# EAGLE design Trefferzonenmodul (EAGLE 7.2.0)
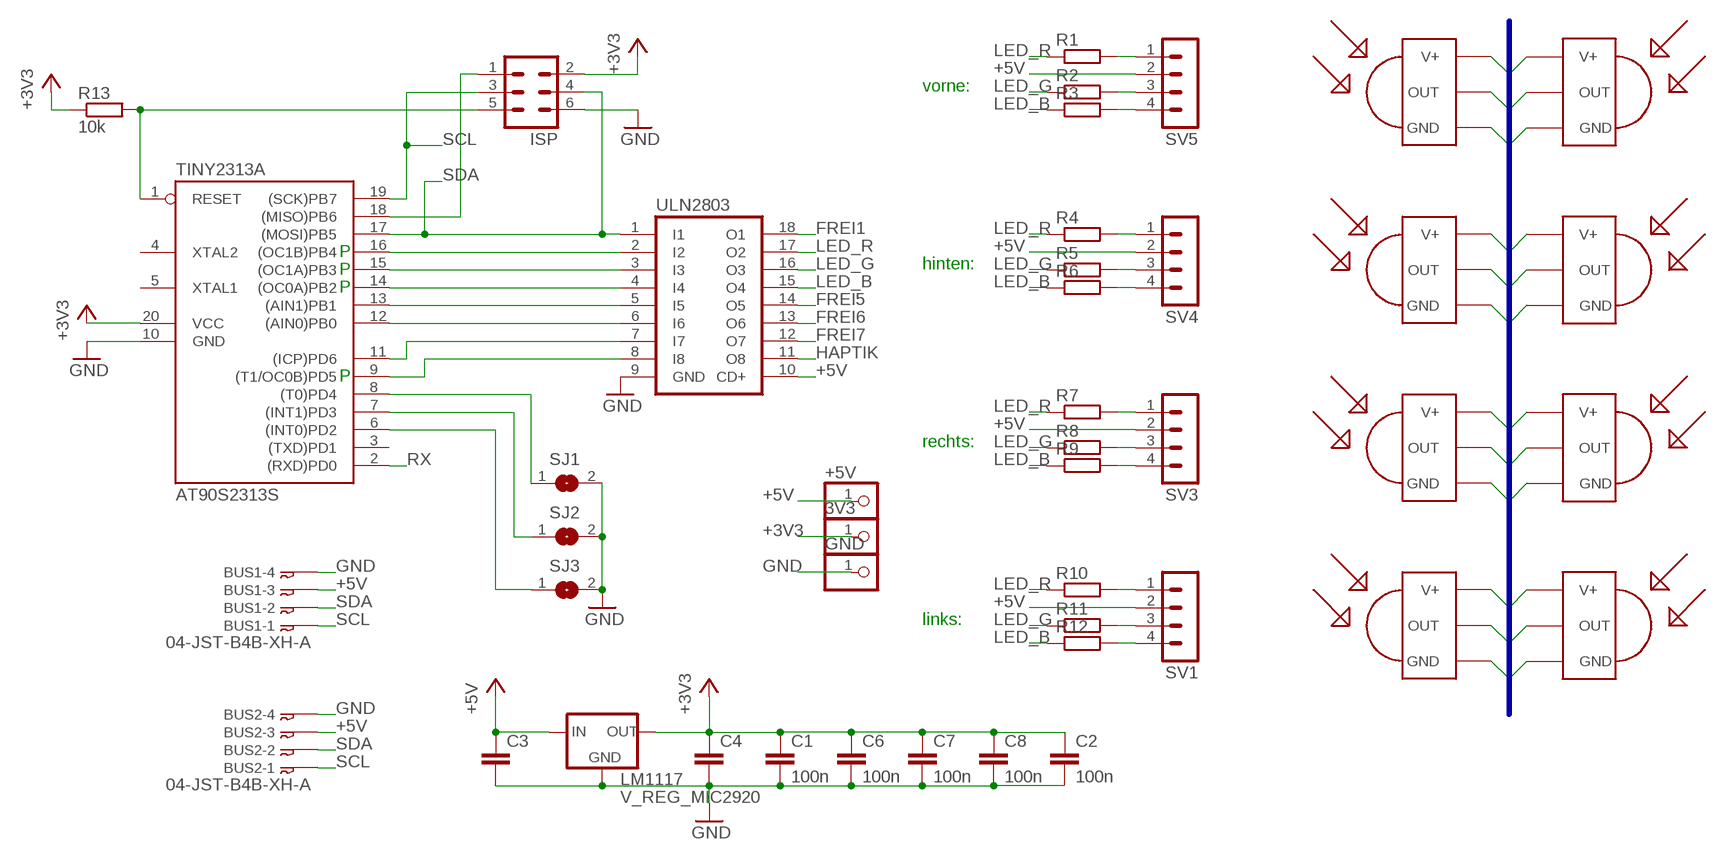
[diagram p0: schematic, sheet 1]

## Parts
3V3  PINHD-1X1  [1X01]
+5V  PINHD-1X1  [1X01]
BUS1  04-JST-B4B-XH-A  [B4B-XH]
BUS2  04-JST-B4B-XH-A  [B4B-XH]
C1  100n  C-EUC0805  [C0805]
C2  100n  C-EUC0805  [C0805]
C3  C-EUC1210  [C1210]
C4  C-EUC1210  [C1210]
C6  100n  C-EUC0805  [C0805]
C7  100n  C-EUC0805  [C0805]
C8  100n  C-EUC0805  [C0805]
GND  PINHD-1X1  [1X01]
ISP  MA03-2  [MA03-2]
LM1117  V_REG_MIC2920  [SOT223]
R1  R-EU_R0805  [R0805]
R2  R-EU_R0805  [R0805]
R3  R-EU_R0805  [R0805]
R4  R-EU_R0805  [R0805]
R5  R-EU_R0805  [R0805]
R6  R-EU_R0805  [R0805]
R7  R-EU_R0805  [R0805]
R8  R-EU_R0805  [R0805]
R9  R-EU_R0805  [R0805]
R10  R-EU_R0805  [R0805]
R11  R-EU_R0805  [R0805]
R12  R-EU_R0805  [R0805]
R13  10k  R-EU_R0805  [R0805]
SJ1  SJ  [SJ]
SJ2  SJ  [SJ]
SJ3  SJ  [SJ]
SV1  MA04-1  [MA04-1]
SV3  MA04-1  [MA04-1]
SV4  MA04-1  [MA04-1]
SV5  MA04-1  [MA04-1]
TINY2313A  AT90S2313S  [SO20L]
U$1  TSOP1838  [TSOP18XX]
U$2  TSOP1838  [TSOP18XX]
U$3  TSOP1838  [TSOP18XX]
U$4  TSOP1838  [TSOP18XX]
U$5  TSOP1838  [TSOP18XX]
U$6  TSOP1838  [TSOP18XX]
U$7  TSOP1838  [TSOP18XX]
U$8  TSOP1838  [TSOP18XX]
ULN2803  ULN2803ASO18  [SO18W]

## Nets
+3V3: 3V3.1 C1.1 C2.1 C4.1 C6.1 C7.1 C8.1 ISP.2 LM1117.2(OUT) LM1117.4(OUT) R13.1 TINY2313A.20(VCC) U$1.VCC(V+) U$2.VCC(V+) U$3.VCC(V+) U$4.VCC(V+) U$5.VCC(V+) U$6.VCC(V+) U$7.VCC(V+) U$8.VCC(V+)
+5V: +5V.1 BUS1.P$3 BUS2.P$3 C3.1 LM1117.3(IN) SV1.2 SV3.2 SV4.2 SV5.2 ULN2803.10(CD+)
FREI1: ULN2803.18(O1)
FREI5: ULN2803.14(O5)
FREI6: ULN2803.13(O6)
FREI7: ULN2803.12(O7)
GND: BUS1.P$4 BUS2.P$4 C1.2 C2.2 C3.2 C4.2 C6.2 C7.2 C8.2 GND.1 ISP.6 LM1117.1(GND) SJ1.2 SJ2.2 SJ3.2 TINY2313A.10(GND) U$1.GND U$2.GND U$3.GND U$4.GND U$5.GND U$6.GND U$7.GND U$8.GND ULN2803.9(GND)
HAPTIK: ULN2803.11(O8)
LED_B: R3.1 R6.1 R9.1 R12.1 ULN2803.15(O4)
LED_G: R2.1 R5.1 R8.1 R11.1 ULN2803.16(O3)
LED_R: R1.1 R4.1 R7.1 R10.1 ULN2803.17(O2)
N$1: ISP.1 TINY2313A.18((MISO)PB6)
N$2: SJ1.1 TINY2313A.8((T0)PD4)
N$3: TINY2313A.16((OC1B)PB4) ULN2803.2(I2)
N$4: TINY2313A.15((OC1A)PB3) ULN2803.3(I3)
N$5: R10.2 SV1.1
N$6: R11.2 SV1.3
N$7: TINY2313A.14((OC0A)PB2) ULN2803.4(I4)
N$8: TINY2313A.13((AIN1)PB1) ULN2803.5(I5)
N$9: TINY2313A.12((AIN0)PB0) ULN2803.6(I6)
N$10: TINY2313A.11((ICP)PD6) ULN2803.7(I7)
N$11: TINY2313A.9((T1/OC0B)PD5) ULN2803.8(I8)
N$12: R12.2 SV1.4
N$13: R7.2 SV3.1
N$14: R8.2 SV3.3
N$15: R9.2 SV3.4
N$16: R4.2 SV4.1
N$17: R5.2 SV4.3
N$18: SJ2.1 TINY2313A.7((INT1)PD3)
N$19: SJ3.1 TINY2313A.6((INT0)PD2)
N$22: R6.2 SV4.4
N$23: ISP.5 R13.2 TINY2313A.1(RESET)
N$24: R1.2 SV5.1
N$25: R2.2 SV5.3
N$26: R3.2 SV5.4
RX: TINY2313A.2((RXD)PD0) U$1.OUT U$2.OUT U$3.OUT U$4.OUT U$5.OUT U$6.OUT U$7.OUT U$8.OUT
SCL: BUS1.P$1 BUS2.P$1 ISP.3 TINY2313A.19((SCK)PB7)
SDA: BUS1.P$2 BUS2.P$2 ISP.4 TINY2313A.17((MOSI)PB5) ULN2803.1(I1)
Unconnected: TINY2313A.3((TXD)PD1) TINY2313A.4(XTAL2) TINY2313A.5(XTAL1)

## Buses
+3V3,GND,RX

## Notes on the sheet
- vorne:
- P
- hinten:
- P
- P
- P
- rechts:
- links:

## Library data of the parts
3V3 +5V GND = wz:PINHD-1X1: PIN HEADER
BUS1 BUS2 = wz:04-JST: JST CONNECTOR
C1-C4 C6-C8 = rcl:C-EU: CAPACITOR, European symbol
ISP = con-lstb:MA03-2: PIN HEADER; OC_FARNELL: unknown; OC_NEWARK: unknown
LM1117 = wz:V_REG_MIC2920: MIC2920A (http://www.micrel.com/_PDF/mic2920.pdf) - 400mA output LDO Regulator
R1-R13 = rcl:R-EU_: RESISTOR, European symbol
SJ1-SJ3 = jumper:SJ: SMD solder JUMPER
SV1 SV3-SV5 = con-lstb:MA04-1: PIN HEADER; OC_FARNELL: unknown; OC_NEWARK: unknown
TINY2313A = wz:AT90S2313: MICROCONTROLLER 2 Kbytes FLASH 128 bytes SRAM 128 bytes EEPROM UART; OC_FARNELL: unknown; OC_NEWARK: unknown
U$1-U$8 = tsop:TSOP1838: IR Receiver and Demodulator
ULN2803 = wz:ULN2803A: DRIVER ARRAY

## Net classes
0 default: width 0.016 mm

## Board
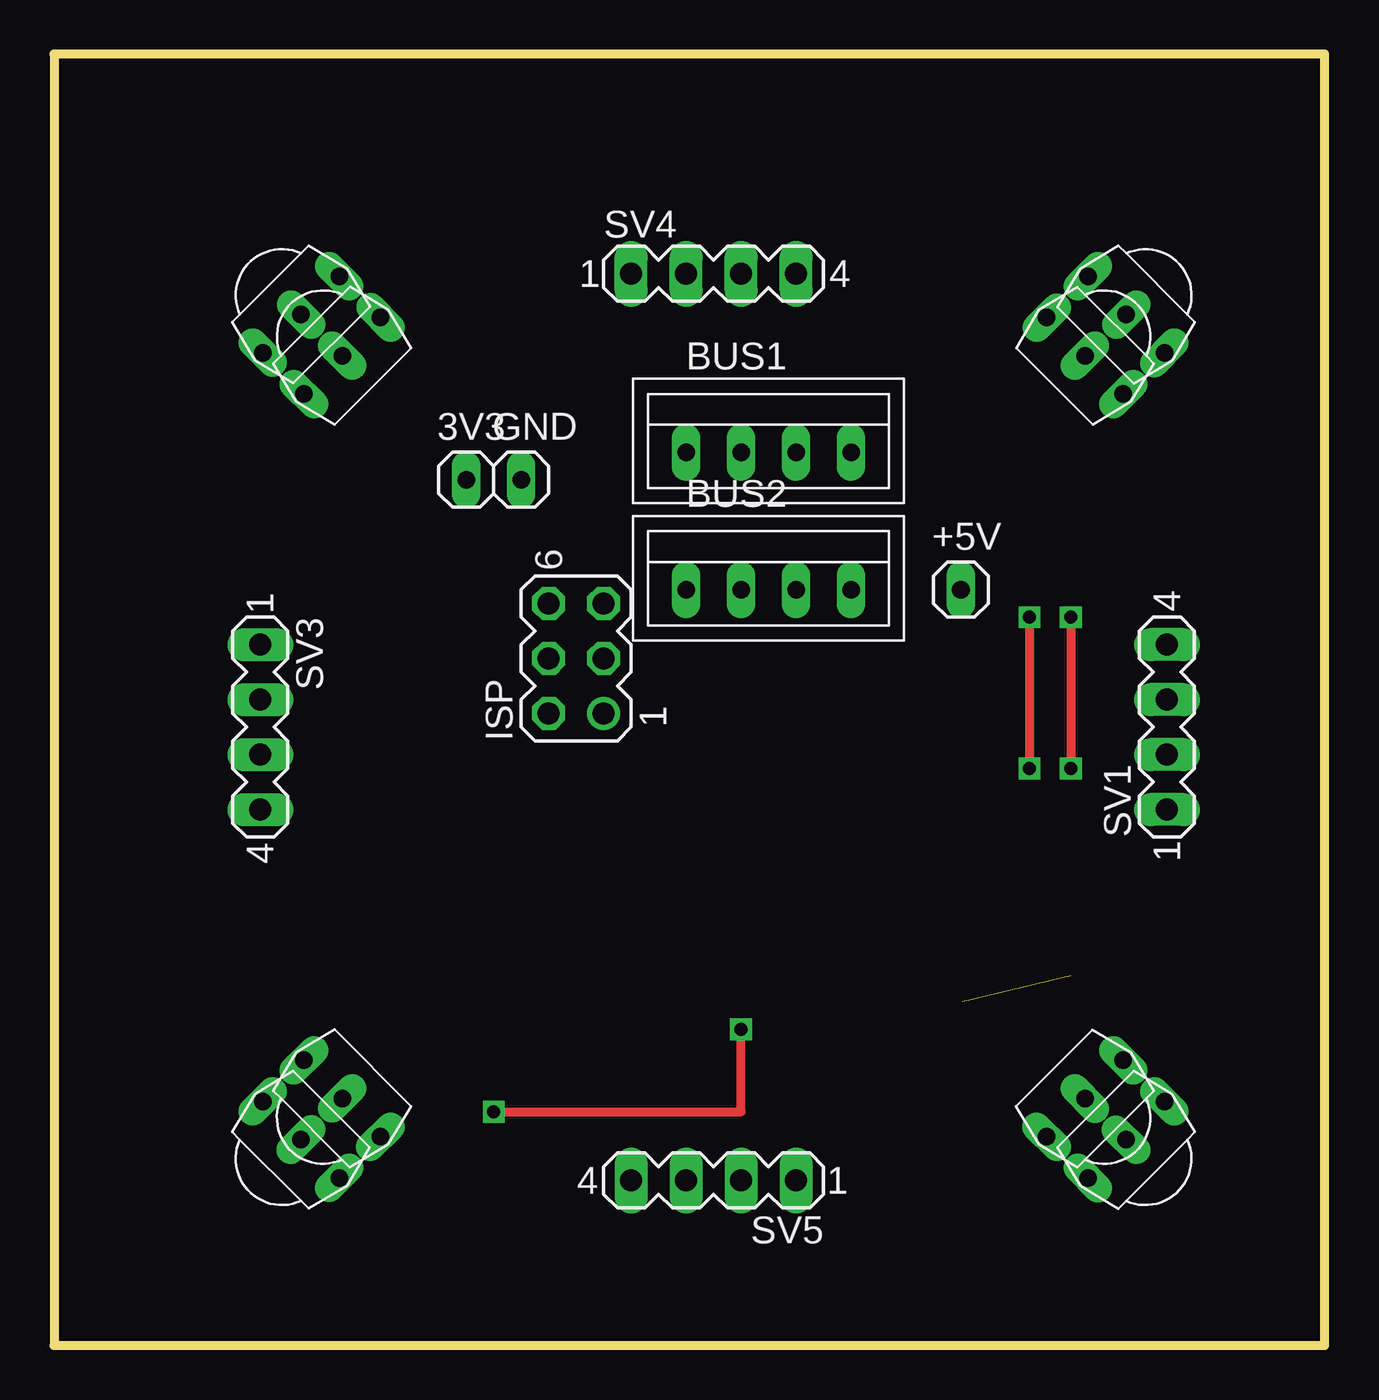
[diagram p1: board, top side]
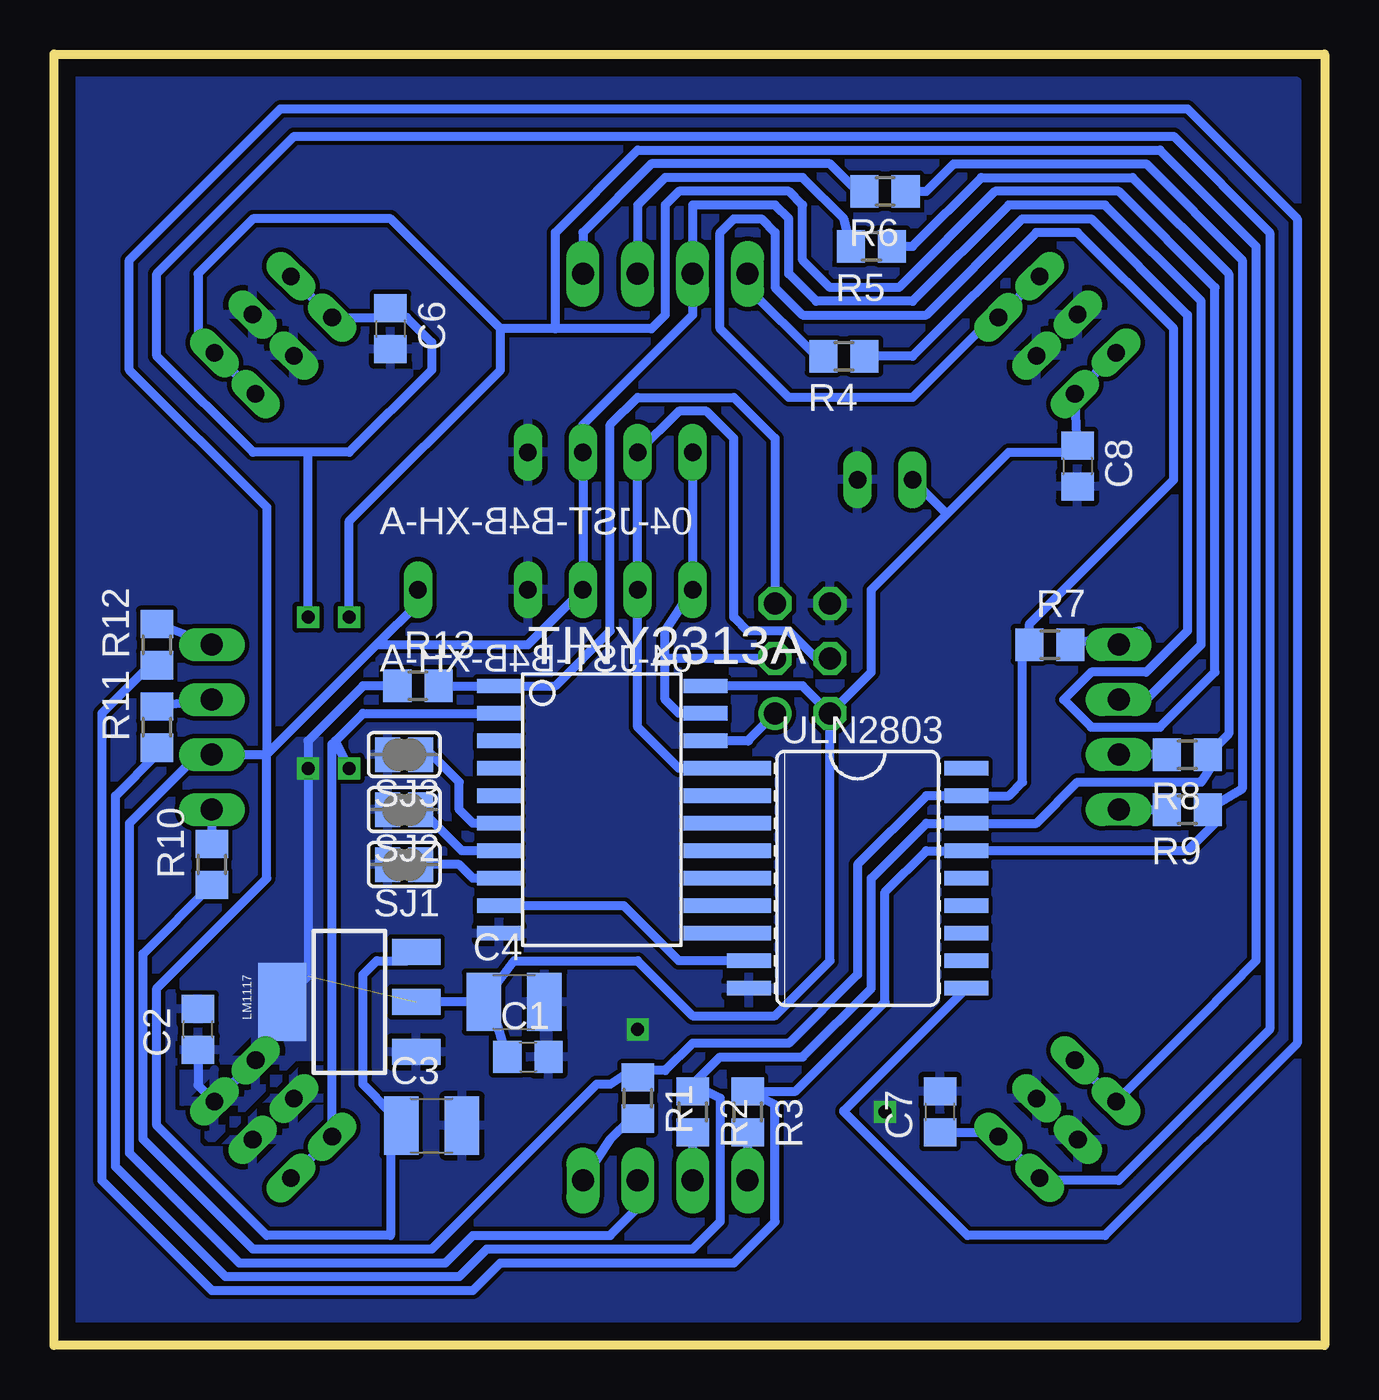
[diagram p2: board, bottom side, seen from below]

Size 58.73 x 59.68 mm. Coordinates in mm from the lower left corner, seen from the top.
Outline: 0,0 58.73,0 58.73,59.68 0,59.68 0,0
Copper layers (1*16): Top 0.035mm / dielectric 1.5mm / Bottom 0.035mm
Design rules "cnc": minimum track width 10mil, minimum drill 0.1mm, track to track 8mil, track to pad 8mil, pad to pad 8mil, via to via 8mil, smd to smd 8mil, copper to edge 30mil, drill to drill 8mil, minimum pad ring 10mil, minimum via ring 8mil, stop-mask expansion 4mil, vias tented up to drill 0mil, thermal gap 10mil

### Footprints (pad centres in the part's own frame; a part is rotated, then mirrored left to right if it is on the bottom)
1X01 = drill 0.813 long: 1 0,0
B4B-XH = drill 0.813 long: P$1 -3.81,0; P$2 -1.27,0; P$3 1.27,0; P$4 3.81,0
C0805 = smd 1.3 x 1.5: 1 -0.95,0; 2 0.95,0
C1210 = smd 1.6 x 2.7: 1 -1.4,0; 2 1.4,0
MA03-2 = drill 1.016: 1 -2.54,-1.27 | drill 1.016 octagon: 2 -2.54,1.27; 3 0,-1.27; 4 0,1.27; 5 2.54,-1.27; 6 2.54,1.27
SOT223 = smd 1.219 x 2.235: 1 -2.311,-3.099; 2 0,-3.099; 3 2.311,-3.099 | smd 3.6 x 2.2: 4 0,3.099
R0805 = smd 1.3 x 1.5: 1 -0.95,0; 2 0.95,0
SJ = smd 1.168 x 1.6: 1 -0.762,0; 2 0.762,0
MA04-1 = drill 1.016 long: 1 -3.81,0; 2 -1.27,0; 3 1.27,0; 4 3.81,0
SO20L = smd 0.66 x 2.032: 1 -5.08,-5.131; 2 -3.81,-5.131; 3 -2.54,-5.131; 4 -1.27,-5.131; 5 0,-5.131; 6 1.27,-5.131; 7 2.54,-5.131; 8 3.81,-5.131; 9 5.08,-5.131; 10 6.35,-5.131; 11 6.35,4.394; 12 5.08,4.394; 13 3.81,4.394; 14 2.54,4.394; 15 1.27,4.394; 16 0,4.394; 17 -1.27,4.394; 18 -2.54,4.394; 19 -3.81,4.394; 20 -5.08,4.394
TSOP18XX = drill 0.813 long: GND -0.001,-0.027; OUT -2.501,-0.027; VCC 2.499,-0.027
SO18W = smd 0.66 x 2.032: 1 -5.08,-5.029; 2 -3.81,-5.029; 3 -2.54,-5.029; 4 -1.27,-5.029; 5 0,-5.029; 6 1.27,-5.029; 7 2.54,-5.029; 8 3.81,-5.029; 9 5.08,-5.029; 10 5.08,5.029; 11 3.81,5.029; 12 2.54,5.029; 13 1.27,5.029; 14 0,5.029; 15 -1.27,5.029; 16 -2.54,5.029; 17 -3.81,5.029; 18 -5.08,5.029

### Placement (x,y rotation side)
3V3  19.05,40.01 0 top
+5V  41.91,34.92 0 top
BUS1  33.02,41.27 0 top
BUS2  33.02,34.92 0 top
C1  36.83,13.34 0 bottom
C2  52.07,14.61 90 bottom
C3  41.27,10.16 0 bottom
C4  37.47,15.88 0 bottom
C6  43.18,46.99 270 bottom
C7  17.78,10.79 90 bottom
C8  11.43,40.64 270 bottom
GND  21.59,40.01 0 top
ISP  24.13,31.75 90 top
LM1117  45.09,15.88 90 bottom
R1  31.75,11.43 270 bottom
R2  29.21,10.79 270 bottom
R3  26.67,10.79 270 bottom
R4  22.23,45.72 180 bottom
R5  20.95,50.8 180 bottom
R6  20.32,53.34 180 bottom
R7  12.7,32.38 0 bottom
R8  6.35,27.3 180 bottom
R9  6.35,24.77 180 bottom
R10  51.44,22.23 90 bottom
R11  53.98,28.57 90 bottom
R12  53.98,32.38 90 bottom
R13  41.91,30.48 0 bottom
SJ1  42.55,22.23 180 bottom
SJ2  42.55,24.77 180 bottom
SJ3  42.55,27.3 180 bottom
SV1  51.44,28.57 90 top
SV3  9.53,28.57 270 top
SV4  30.48,49.53 0 top
SV5  30.48,7.62 180 top
TINY2313A  33.02,25.4 270 bottom
U$1  49.53,47.62 135 top
U$2  11.43,47.62 225 top
U$3  11.43,9.53 315 top
U$4  49.53,9.53 45 top
U$5  13.34,11.43 315 top
U$6  47.62,11.43 45 top
U$7  47.62,45.72 135 top
U$8  13.34,45.72 225 top
ULN2803  21.59,21.59 270 bottom

### Tracks (layer width: path | path; a pad name or v marks a point on that pad's centre or on a via)
+3V3  (via drill 0.6)  (1 unrouted)
  Top 0.406: v46.99,33.66 v46.99,26.67
  Bottom 0.406: C1.1 38.41,15.43 C4.1 | C4.1 LM1117.2 | C4.1 37.47,17.78 31.75,17.78 29.21,15.24 25.4,15.24 22.86,17.78 ISP.2 | ISP.2 24.13,30.48 TINY2313A.20 | ISP.2 20.95,31.11 20.95,34.92 17.46,38.42 | U$2.VCC U$8.VCC C8.1 11.74,41.27 14.61,41.27 17.46,38.42 | U$1.VCC U$7.VCC 43.61,47.51 | 43.61,47.51 C6.1 | C7.1 15.28,9.85 U$5.VCC U$3.VCC 13.06,7.62 9.53,7.62 2.54,14.61 2.54,51.44 6.99,55.88 47.62,55.88 53.98,49.53 53.98,45.72 49.53,41.27 46.99,41.27 | 43.61,47.51 42.43,47.51 41.27,46.35 41.27,45.09 45.09,41.27 46.99,41.27 | R13.1 44.45,30.48 46.99,27.94 v46.99,26.67 46.99,17.07 LM1117.4 U$6.VCC U$4.VCC 52.07,12.03 C2.1 | v46.99,33.66 46.99,41.27 | 3V3.1 17.46,38.42
  pour Bottom: 46.35,13.34 47.62,13.34 51.44,9.53 52.7,10.79 52.7,14.61 51.44,14.61 51.44,16.51 52.7,16.51 52.7,17.14 48.26,21.59 48.26,27.3 47.62,27.94 46.35,27.94
+5V
  Bottom 0.406: SV5.2 31.75,6.35 33.02,5.08 39.37,5.08 40.64,3.81 50.16,3.81 55.24,8.89 55.24,24.13 52.07,27.3 SV1.2 48.9,27.3 | SV3.2 8.26,29.84 5.71,32.38 5.71,48.26 10.16,52.7 14.61,52.7 19.05,48.26 23.5,48.26 24.77,49.53 24.77,52.07 25.4,52.7 29.21,52.7 SV4.2 29.21,47.62 34.29,42.55 BUS1.P$3 BUS2.P$3 36.83,32.38 43.81,32.38 | 48.9,27.3 43.81,32.38 | 48.9,27.3 48.9,21.59 53.98,16.51 53.98,10.16 48.9,5.08 43.18,5.08 43.18,10.16 C3.1 43.95,11.56 44.45,12.06 44.45,17.14 43.81,17.78 42.39,17.78 LM1117.3 | 48.9,27.3 48.9,38.73 55.24,45.09 55.24,50.16 48.26,57.15 6.35,57.15 1.27,52.07 1.27,13.97 10.16,5.08 16.51,5.08 22.23,10.79 22.23,10.85 ULN2803.10 | 43.81,32.38 41.91,34.29 +5V.1
GND  (via drill 0.6)
  Top 0.406: v20.32,10.79 31.75,10.79 v31.75,14.61
  pour Bottom (rank 2): 1.27,58.42 57.78,58.42 57.78,1.27 1.27,1.27
LED_B
  Bottom 0.406: R6.1 18.41,53.34 17.14,54.61 8.26,54.61 3.81,50.16 3.81,25.72 R9.1 5.08,24.77 5.08,24.13 6.35,22.86 ULN2803.15 18.41,22.86 20.32,20.95 20.32,15.88 24.45,11.74 R3.1 25.4,11.11 25.4,5.71 27.3,3.81 38.1,3.81 39.37,2.54 51.44,2.54 56.52,7.62 56.52,29.21 54.29,31.43 R12.1
LED_G
  Bottom 0.406: R2.1 29.21,12.06 | 29.21,12.06 27.94,13.34 24.13,13.34 20.95,16.51 20.95,21.59 18.41,24.13 ULN2803.16 13.34,24.13 11.43,26.04 5.71,26.04 5.08,26.99 R8.1 4.45,28.26 4.45,49.53 8.89,53.98 15.88,53.98 19.05,50.8 R5.1 | 29.21,12.06 27.94,11.43 27.94,5.71 29.21,4.45 38.73,4.45 40.01,3.17 50.8,3.17 55.88,8.26 55.88,25.4 53.98,27.3 R11.1
LED_R
  Bottom 0.406: 32.06,12.7 30.48,12.7 29.21,13.97 24.77,13.97 21.59,17.14 21.59,22.23 18.41,25.4 ULN2803.17 14.61,25.4 13.97,26.04 13.97,32.06 R7.1 13.65,33.34 6.99,40.01 6.99,46.99 11.43,51.44 13.34,51.44 19.05,45.72 R4.1 | 32.06,12.7 R1.1 | 32.06,12.7 33.02,12.06 33.66,12.06 41.27,4.45 49.53,4.45 54.61,9.53 54.61,18.1 R10.1
N$1
  Bottom 0.406: 26.67,27.94 TINY2313A.18 | 26.67,27.94 ISP.1 | 26.67,27.94 26.62,27.94
N$2
  Bottom 0.406: TINY2313A.8 39.37,21.59 40.01,22.23 SJ1.1
N$3
  Bottom 0.406: ULN2803.2 TINY2313A.16
N$4
  Bottom 0.406: TINY2313A.15 ULN2803.3
N$5
  Bottom 0.406: SV1.1 R10.2
N$6
  Bottom 0.406: SV1.3 R11.2
N$7
  Bottom 0.406: TINY2313A.14 ULN2803.4
N$8
  Bottom 0.406: ULN2803.5 TINY2313A.13
N$9
  Bottom 0.406: TINY2313A.12 ULN2803.6
N$10
  Bottom 0.406: ULN2803.7 TINY2313A.11
N$11
  Bottom 0.406: ULN2803.8 29.84,17.78 32.38,20.32 TINY2313A.9
N$12
  Bottom 0.406: SV1.4 R12.2
N$13
  Bottom 0.406: SV3.1 8.57,33.02 R7.2
N$14
  Bottom 0.406: R8.2 SV3.3
N$15
  Bottom 0.406: SV3.4 R9.2
N$16
  Bottom 0.406: R4.2 23.5,45.72 26.67,48.9 SV4.1
N$17
  Bottom 0.406: R5.2 22.23,52.07 24.13,53.98 30.48,53.98 31.75,52.7 SV4.3
N$18
  Bottom 0.406: TINY2313A.7 39.88,22.86 SJ2.1
N$19
  Bottom 0.406: TINY2313A.6 39.37,24.13 40.01,24.77 40.01,26.04 41.27,27.3 SJ3.1
N$22
  Bottom 0.406: R6.2 21.59,53.34 22.86,54.61 31.11,54.61 34.29,51.44 SV4.4
N$23
  Bottom 0.406: ISP.5 25.4,41.91 27.3,43.81 31.75,43.81 33.02,42.55 33.02,33.02 35.56,30.48 TINY2313A.1 R13.2 41.27,30.48
N$24
  Bottom 0.406: R1.2 32.06,10.48 33.02,9.53 SV5.1
N$25
  Bottom 0.406: R2.2 SV5.3
N$26
  Bottom 0.406: R3.2 SV5.4
RX  (via drill 0.6)
  Top 0.406: v45.09,33.66 v45.09,26.67
  Bottom 0.406: U$4.OUT U$6.OUT 45.88,27.79 45.72,27.94 | 45.72,27.94 44.45,29.21 TINY2313A.2 | U$2.OUT U$8.OUT 15.36,47.51 19.05,43.81 24.77,43.81 27.94,46.99 27.94,51.44 27.3,52.07 26.04,52.07 25.4,51.44 25.4,48.9 24.13,47.62 18.41,47.62 13.97,52.07 10.79,52.07 6.35,47.62 6.35,33.02 8.26,31.11 10.79,31.11 12.06,29.84 10.79,28.57 7.62,28.57 5.08,31.11 5.08,48.9 9.53,53.34 15.24,53.34 19.68,48.9 22.86,48.9 24.13,50.16 24.13,52.7 24.77,53.34 29.84,53.34 30.48,52.7 30.48,47.62 31.11,46.99 35.56,46.99 | 35.56,46.99 38.1,46.99 | 38.1,46.99 43.18,52.07 49.53,52.07 52.07,49.53 52.07,46.63 U$1.OUT U$7.OUT | 35.56,46.99 35.56,51.44 31.75,55.24 7.62,55.24 3.17,50.8 3.17,17.78 5.68,15.24 U$3.OUT U$5.OUT | v45.09,33.66 45.09,38.1 38.1,45.09 38.1,46.99 | v45.09,26.67 45.72,27.94
SCL
  Bottom 0.406: TINY2313A.19 29.84,29.21 30.48,29.84 30.48,31.75 | 30.48,31.75 30.48,33.02 BUS2.P$1 BUS1.P$1 | ISP.3 30.48,31.75
SDA
  Bottom 0.406: ISP.4 23.5,31.75 24.77,33.02 26.67,33.02 27.3,33.66 27.3,41.91 28.57,43.18 29.84,43.18 BUS1.P$2 BUS2.P$2 31.75,28.57 29.84,26.67 TINY2313A.17 ULN2803.1